# EAGLE design lt3042 (EAGLE 7.4.0)
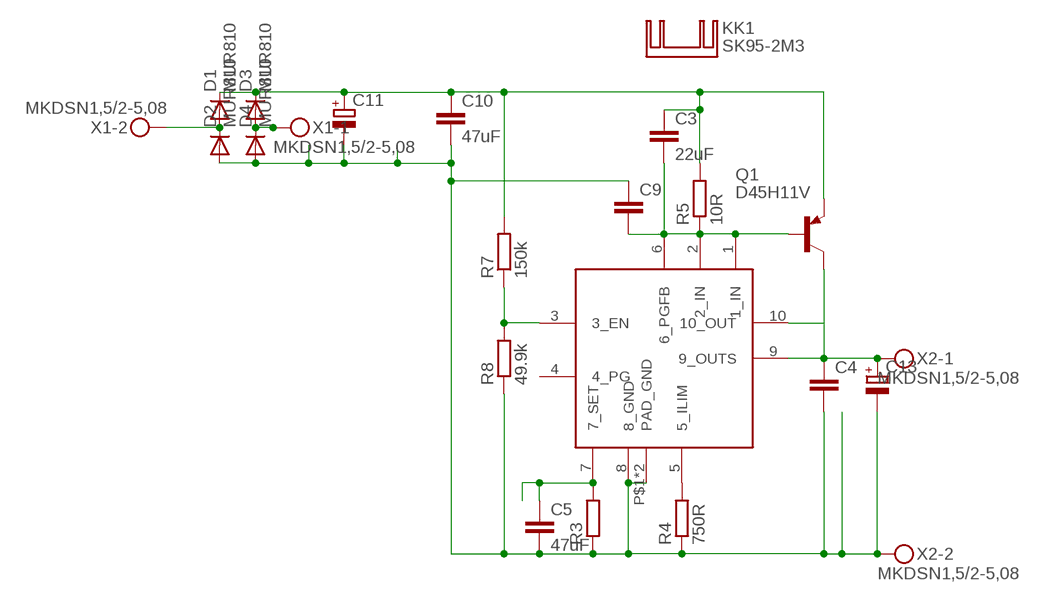
[diagram p0: schematic, sheet 1]

## Parts
C3  22uF  C-EUC1210  [C1210]
C4  C-EUC1206  [C1206]
C5  47uF  C-EUC1210  [C1210]
C9  C-EUC1206  [C1206]
C10  47uF  C-EUC1210  [C1210]
C11  CPOL-EUE7.5-18  [E7,5-18]
C13  CPOL-EUE5-10.5  [E5-10,5]
D1  MUR810  [TO220ACS]
D2  MUR810  [TO220ACS]
D3  MUR810  [TO220ACS]
D4  MUR810  [TO220ACS]
KK1  SK95-2M3  [SK95-2M3]
Q1  D45H11V  [TO220V]
R3  R-EU_R1206  [R1206]
R4  750R  R-EU_R1206  [R1206]
R5  10R  R-EU_R1206  [R1206]
R7  150k  R-EU_R1206  [R1206]
R8  49.9k  R-EU_R1206  [R1206]
U$1  LT3042  [MSOP-10]
X1  MKDSN1,5/2-5,08  [MKDSN1,5/2-5,08]
X2  MKDSN1,5/2-5,08  [MKDSN1,5/2-5,08]

## Nets
EN: R7.1 R8.2 U$1.3(3_EN)
GND: C4.2 C5.2 C9.1 C10.2 C11.- C13.- D2.A D4.A R3.1 R4.1 R8.1 U$1.8(8_GND) U$1.P$1(PAD_GND) U$1.P$2(PAD_GND) X2.2
ILIM: R4.2 U$1.5(5_ILIM)
N$1: D1.A D2.C X1.2
N$2: C3.1 C10.1 C11.+ D1.C D3.C Q1.3(E) R5.2 R7.2
N$8: D3.A D4.C X1.1
SET: C5.1 R3.2 U$1.7(7_SET)
VIN: C3.2 C9.2 Q1.1(B) R5.1 U$1.1(1_IN) U$1.2(2_IN) U$1.6(6_PGFB)
VOUT: C4.1 C13.+ Q1.2(C) U$1.9(9_OUTS) U$1.10(10_OUT) X2.1
Unconnected: U$1.4(4_PG)

## Library data of the parts
C3-C5 C9 C10 = Vwvwbg:C-EU: CAPACITOR, European symbol
C11 C13 = Vwvwbg:CPOL-EU: POLARIZED CAPACITOR, European symbol
D1-D4 = diode:MUR810: DIODE
KK1 = heatsink:SK95-2M3: HEATSINK manufacturer Fischer/distributor Buerklin
Q1 = tranzistory PNP:D45H11: PNP Transistor
R3-R5 R7 R8 = Vwvwbg:R-EU_: RESISTOR, European symbol
U$1 = Vwvwbg:LT3042
X1 X2 = con-phoenix-508:MKDSN1,5/2-5,08: MKDSN 1,5/ 2-5,08 Printklemme Nennstrom: 13,5 A Nennspannung: 250 V Rastermaß: 5,08 mm Polzahl: 2 Anschlussart: Schraubanschluss Montage: Löten Anschlussrichtung Leiter/Platine: 0 ° Artikelnummer: 1729128 Source: http://eshop.phoenixcontact.com .. 1729128.pdf

## Board
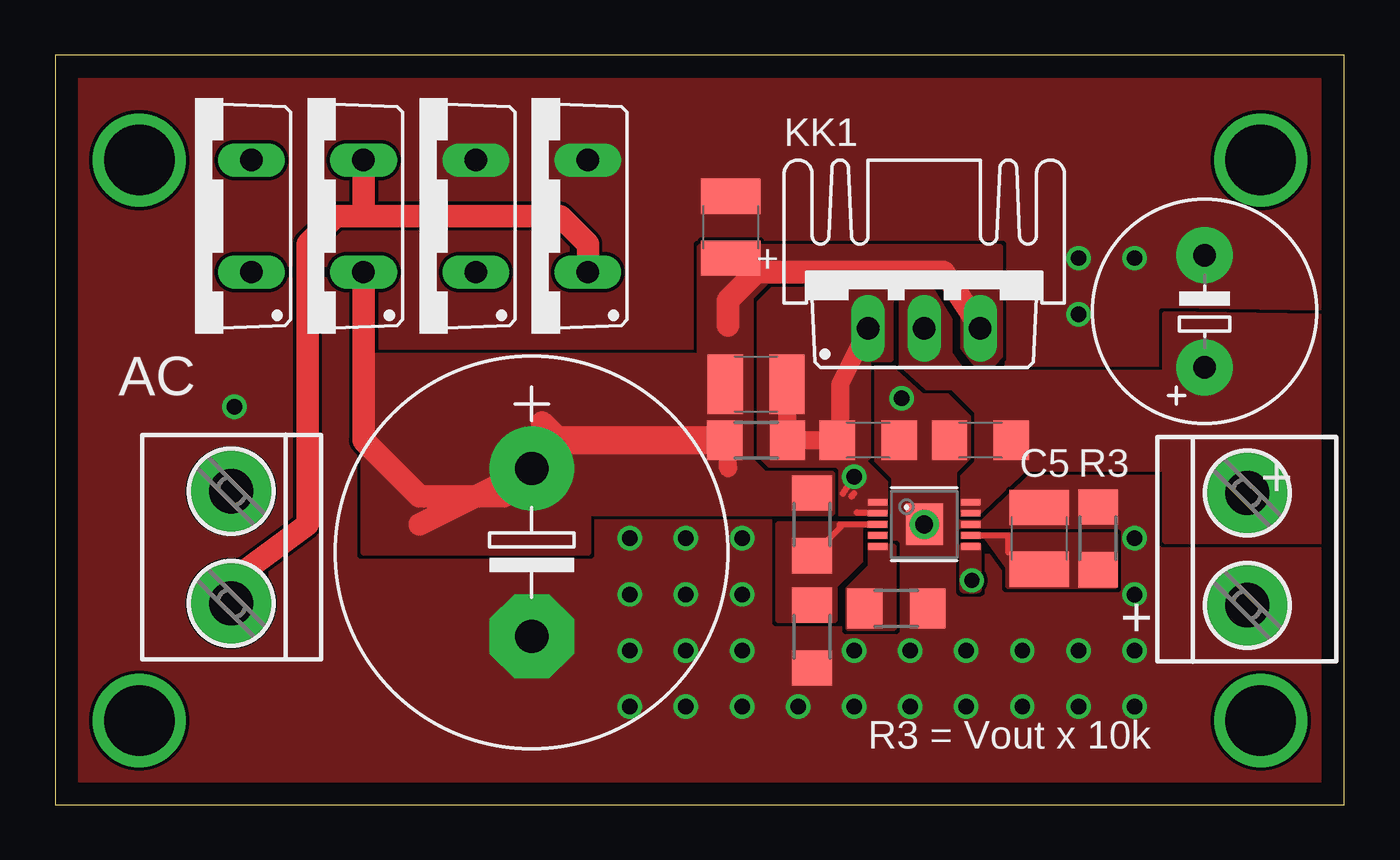
[diagram p1: board, top side]
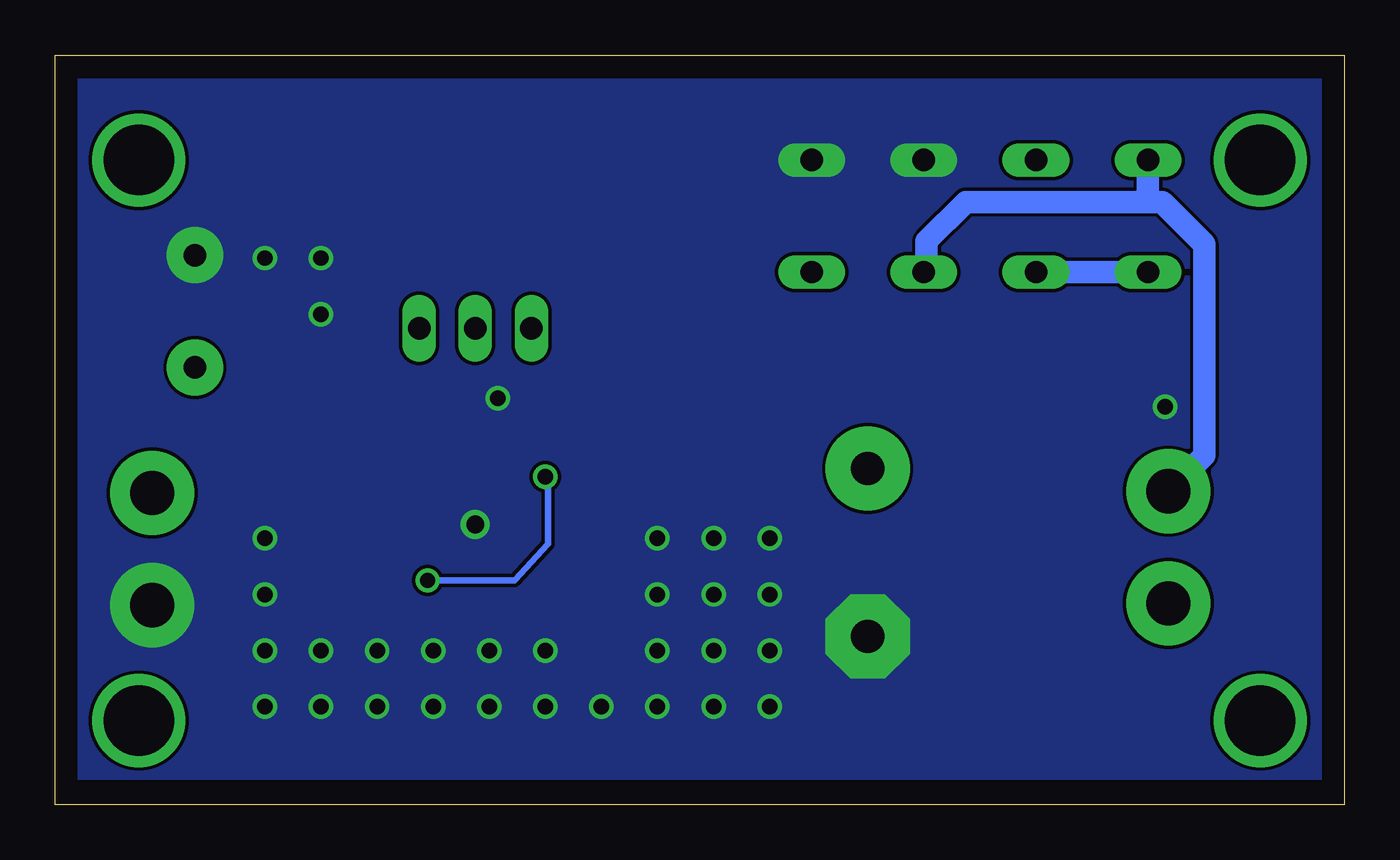
[diagram p2: board, bottom side, seen from below]

Size 58.4 x 33.96 mm. Coordinates in mm from the lower left corner, seen from the top.
Outline: 0,0 58.4,0 58.4,33.96 0,33.96 0,0
Copper layers (1*16): Top 0.035mm / dielectric 1.5mm / Bottom 0.035mm
Design rules "default *": minimum track width 10mil, minimum drill 24mil, track to track 6mil, track to pad 6mil, pad to pad 6mil, via to via 6mil, smd to smd 6mil, copper to edge 40mil, drill to drill 6mil, minimum pad ring 10mil, minimum via ring 8mil, stop-mask expansion 4mil, vias tented up to drill 0mil, thermal gap 10mil

### Footprints (pad centres in the part's own frame; a part is rotated, then mirrored left to right if it is on the bottom)
C1210 = smd 1.6 x 2.7: 1 -1.4,0; 2 1.4,0
C1206 = smd 1.6 x 1.8: 1 -1.4,0; 2 1.4,0
E7,5-18 = drill 1.5 pad 3.81: + -3.81,0 | drill 1.5 pad 3.81 octagon: - 3.81,0
E5-10,5 = drill 1.016 pad 2.54: + -2.54,0; - 2.54,0
TO220ACS = drill 1.016 long: A 2.54,-2.54; C -2.54,-2.54
TO220V = drill 1.016 long: 1 -2.54,-2.54; 2 0,-2.54; 3 2.54,-2.54
R1206 = smd 1.6 x 1.803: 1 -1.422,0; 2 1.422,0
MSOP-10 = smd 0.305 x 0.889: 1 -1,-2.11; 2 -0.5,-2.11; 3 0,-2.11; 4 0.5,-2.11; 5 1,-2.11; 6 1,2.11; 7 0.5,2.11; 8 0,2.11; 9 -0.5,2.11; 10 -1,2.11 | smd 1.88 x 1.676: P$1 0,0 | drill 0.8: P$2 0,0
MKDSN1,5/2-5,08 = drill 2 pad 3.81: 1 -2.561,0.025; 2 2.519,0.025

### Placement (x,y rotation side)
C3  31.75,19.05 0 top
C4  41.91,16.51 180 top
C5  44.58,12.06 90 top
C9  36.83,16.51 180 top
C10  30.61,26.16 90 top
C11  21.59,11.43 270 top
C13  52.07,22.35 90 top
D1  6.35,26.67 90 top
D2  16.51,26.67 90 top
D3  11.43,26.67 90 top
D4  21.59,26.67 90 top
KK1  39.37,24.13 0 top
Q1  39.37,24.13 0 top
R3  47.24,12.06 270 top
R4  38.1,8.89 180 top
R5  31.75,16.51 180 top
R7  34.29,12.7 90 top
R8  34.29,7.62 90 top
U$1  39.37,12.7 270 top
X1  8,11.68 90 top
X2  53.98,11.56 270 top

### Tracks (layer width: path | path; a pad name or v marks a point on that pad's centre or on a via)
EN
  Top 0.305: U$1.3 35.56,12.7 35.56,12.55 R7.1
  pour Top (rank 2, no thermals): 32.77,12.7 36.45,12.7 36.45,11.05 34.92,9.53 32.77,9.53
  pour Top (no thermals): 32.77,9.78 32.77,8.38 35.31,8.38 35.31,10.03 33.02,10.03
GND  (via drill 0.7)
  other vias: 31.12,12.06 31.12,9.53 31.12,6.98 31.12,4.45 33.66,4.45 36.2,4.45 38.73,4.45 38.73,6.98 36.2,6.98 41.27,6.98 41.27,4.45 43.81,4.45 46.35,4.45 43.81,6.98 46.35,6.98 38.35,18.41 28.58,12.06 28.58,9.53 28.58,6.98 28.58,4.45 26.03,4.45 26.03,6.98 26.03,9.53 26.03,12.06 8.13,18.03 46.35,22.22 48.89,24.77 46.35,24.77 48.89,4.45 48.89,6.98 48.89,9.53 48.89,12.06
  pour Top (rank 3, no thermals): -0.51,-1.27 58.42,-1.27 58.42,33.02 -0.51,33.02
  pour Bottom (rank 2, no thermals): -0.51,33.02 58.42,33.02 58.42,1.27 -0.51,1.27
ILIM
  pour Top (rank 2, no thermals): 36.96,11.68 36.96,10.79 35.94,9.78 35.94,8 37.97,8 37.97,11.68
N$1
  Bottom 1.016: 8.89,27.3 8.25,27.3 6.35,25.4 6.35,15.83 X1.2 | 8.89,27.3 17.14,27.3 18.92,25.53 18.92,24.26 D2.C | D1.A 8.89,27.3
N$2
  Top 0.813: 30.48,15.24 30.48,16.36 R5.2
  Top 1.016: Q1.3 40.26,24.13 31.75,24.13 30.48,22.86 30.48,21.71 | 16.51,12.7 C11.+ 20.32,13.97 16.51,13.97 13.97,16.51 D3.C | 22.05,17.32 22.86,16.51
  Top 1.27: R5.2 22.86,16.51
  Bottom 1.016: D1.C D3.C
  pour Top (no thermals): 29.59,22.73 29.59,15.75 31.12,15.75 31.12,22.73
  pour Top (no thermals): 35.18,14.99 35.18,13.21 20.7,13.21 19.69,13.08 19.69,16.51 20.95,20.32 29.21,20.32 29.21,25.27 42.8,25.27 42.8,20.32 42.55,20.07 41.66,20.07 41.15,20.7 41.15,22.73 40.13,23.75 32.26,23.75 31.5,22.99 31.5,15.62 32.13,14.99
  pour Top (no thermals): 13.97,20.32 13.97,11.43 24.13,11.43 24.13,20.32
N$3  (via drill 3.2)
  other vias: 3.81,29.21
N$5  (via drill 3.2)
  other vias: 3.81,3.81
N$6  (via drill 3.2)
  other vias: 54.61,29.21
N$7  (via drill 3.2)
  other vias: 54.61,3.81
N$8
  Top 1.016: D4.C 24.13,25.4 22.86,26.67 13.97,26.67 | 13.97,26.67 12.7,26.67 11.43,25.4 11.43,12.7 6.58,9.12 X1.1 | D3.A 13.97,26.67
SET
  Top 0.305: U$1.7 43.18,12.2 43.18,11.43
  pour Top (rank 2, no thermals): 42.16,12.19 48.01,12.19 48.01,9.91 43.18,9.91 43.18,10.79
VIN  (via drill 0.7)
  Top 0.305: 36.32,13.25 U$1.2 | v36.2,14.86 35.69,14.1 | 36.07,13.97 36.2,14.1 | C9.2 35.56,16.51
  Top 0.813: 33.17,19.03 R5.1 C9.2 35.56,16.64 35.56,19.05 Q1.1
  Bottom 0.305: v41.53,10.16 37.59,10.16 36.07,11.81 36.07,14.73 v36.2,14.86
  pour Top (rank 2, no thermals): 37.59,13.21 37.59,14.61 36.2,16 36.2,17.27 33.53,17.27 33.53,13.21
  pour Top (rank 2, no thermals): 30.86,14.86 36.58,14.73 36.7,15.75 36.83,15.75 36.83,20.19 37.85,20.19 37.85,24.13 30.86,23.5
  pour Top (no thermals): 41.15,11.68 41.15,9.78 41.78,9.78 41.78,11.68
VOUT
  Top 0.813: C4.1
  pour Top (rank 2, no thermals): 41.15,13.33 41.91,13.33 44.07,15.37 44.07,18.54 41.78,18.54 41.78,15.49 41.15,14.86
  pour Top (rank 2, no thermals): 43.18,15.24 58.42,15.24 57.66,19.56 41.53,19.56
  pour Top (rank 2, no thermals): 50.29,22.22 50.29,11.94 58.67,11.94 58.55,22.1
  pour Top (no thermals): 38.35,23.24 39.75,23.24 40.51,21.97 40.51,20.45 41.15,19.56 42.93,19.56 42.93,17.65 41.78,17.65 41.78,17.78 40.64,18.92 39.5,18.92 38.35,19.94

### Text on the board
tPlace: + | AC | + | + | R3 = Vout x 10k